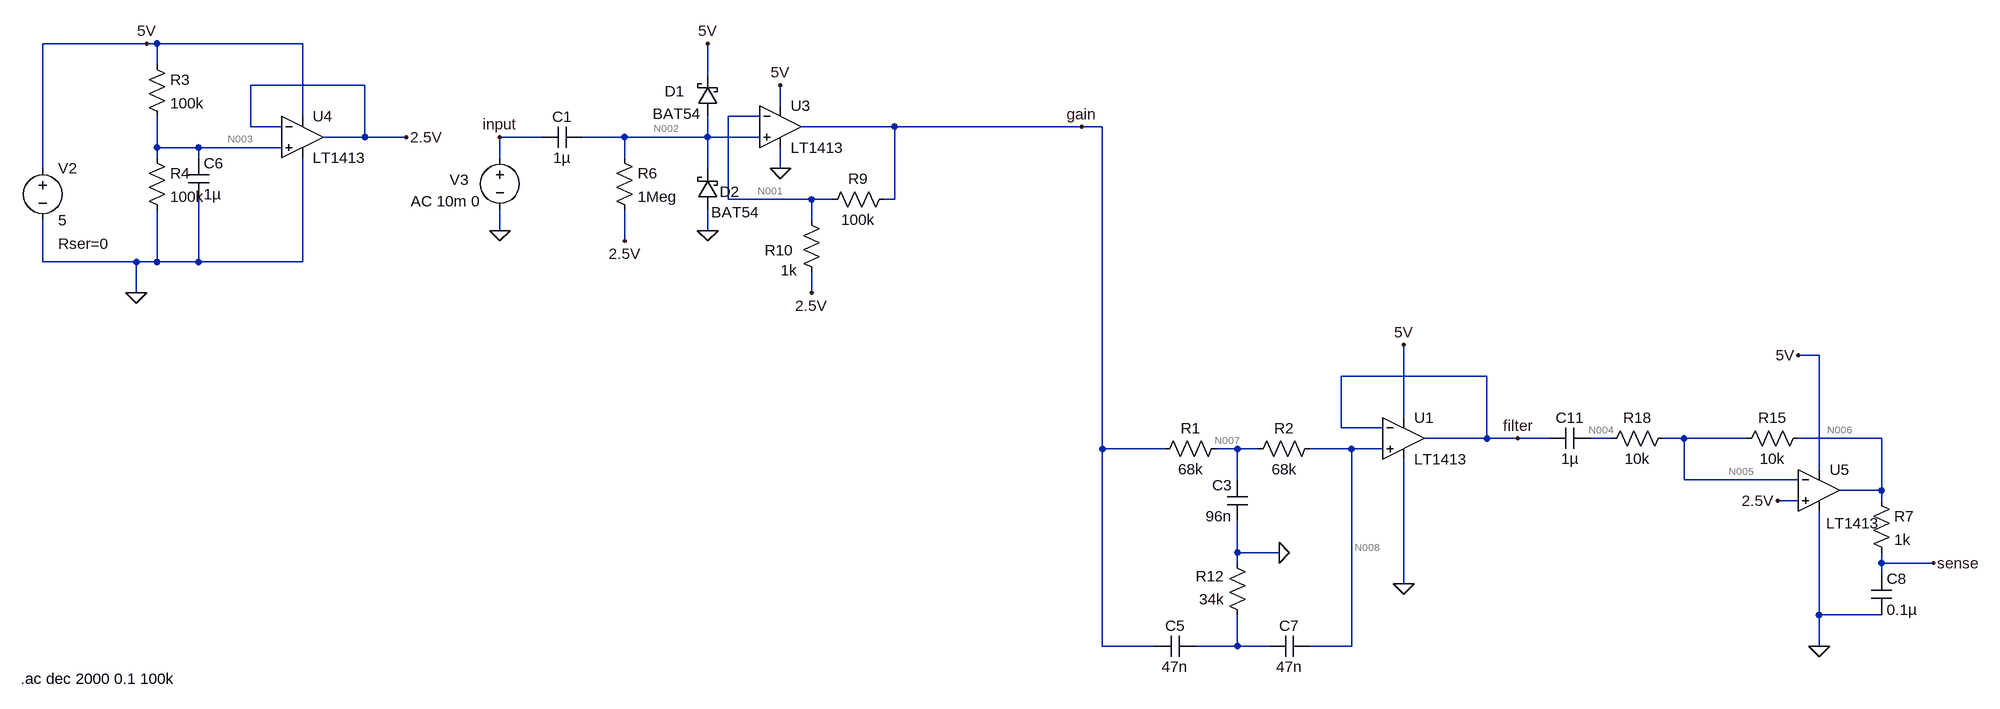
[diagram p0: schematic simulation2.asc]
simulation2.asc, the LTspice schematic file:
Version 4
SHEET 1 1756 1072
WIRE -1088 -16 -1248 -16
WIRE -1072 -16 -1088 -16
WIRE -848 -16 -1072 -16
WIRE -1072 16 -1072 -16
WIRE -224 32 -224 -16
WIRE -752 48 -928 48
WIRE -112 80 -112 48
WIRE -848 96 -848 -16
WIRE -144 96 -192 96
WIRE -928 112 -928 48
WIRE -880 112 -928 112
WIRE 64 112 -80 112
WIRE 352 112 64 112
WIRE 384 112 352 112
WIRE -752 128 -752 48
WIRE -752 128 -816 128
WIRE -688 128 -752 128
WIRE -480 128 -544 128
WIRE -352 128 -416 128
WIRE -224 128 -224 96
WIRE -224 128 -352 128
WIRE -144 128 -224 128
WIRE -1072 144 -1072 96
WIRE -1008 144 -1072 144
WIRE -880 144 -1008 144
WIRE -1072 160 -1072 144
WIRE -1008 160 -1008 144
WIRE -544 160 -544 128
WIRE -352 160 -352 128
WIRE -1248 176 -1248 -16
WIRE -224 176 -224 128
WIRE -112 176 -112 144
WIRE -192 224 -192 96
WIRE -64 224 -192 224
WIRE -32 224 -64 224
WIRE 64 224 64 112
WIRE 64 224 48 224
WIRE -64 256 -64 224
WIRE -544 272 -544 240
WIRE -224 272 -224 240
WIRE -352 288 -352 240
WIRE -1248 320 -1248 256
WIRE -1104 320 -1248 320
WIRE -1072 320 -1072 240
WIRE -1072 320 -1104 320
WIRE -1008 320 -1008 224
WIRE -1008 320 -1072 320
WIRE -848 320 -848 160
WIRE -848 320 -1008 320
WIRE -1104 368 -1104 320
WIRE -64 368 -64 336
WIRE 1488 464 1456 464
WIRE 976 496 752 496
WIRE 848 560 848 448
WIRE 752 576 752 496
WIRE 816 576 752 576
WIRE 976 592 976 496
WIRE 976 592 880 592
WIRE 1024 592 976 592
WIRE 1072 592 1024 592
WIRE 1168 592 1136 592
WIRE 1280 592 1248 592
WIRE 1376 592 1280 592
WIRE 1584 592 1456 592
WIRE 384 608 384 112
WIRE 480 608 384 608
WIRE 592 608 560 608
WIRE 624 608 592 608
WIRE 768 608 704 608
WIRE 816 608 768 608
WIRE 1488 640 1488 464
WIRE 592 656 592 608
WIRE 1280 656 1280 592
WIRE 1456 656 1280 656
WIRE 1584 672 1584 592
WIRE 1584 672 1520 672
WIRE 1456 688 1424 688
WIRE 1584 688 1584 672
WIRE 592 768 592 720
WIRE 656 768 592 768
WIRE 592 784 592 768
WIRE 1584 784 1584 768
WIRE 1664 784 1584 784
WIRE 1584 800 1584 784
WIRE 848 816 848 624
WIRE 1488 864 1488 704
WIRE 1584 864 1488 864
WIRE 384 912 384 608
WIRE 464 912 384 912
WIRE 592 912 592 864
WIRE 592 912 528 912
WIRE 640 912 592 912
WIRE 768 912 768 608
WIRE 768 912 704 912
WIRE 1488 912 1488 864
FLAG -1104 368 0
FLAG -1088 -16 5V
FLAG 1664 784 sense
FLAG -112 176 0
FLAG 352 112 gain
FLAG -544 128 input
FLAG -64 368 2.5V
FLAG 848 816 0
FLAG 848 448 5V
FLAG 1024 592 filter
FLAG 1456 464 5V
FLAG 1424 688 2.5V
FLAG 1488 912 0
FLAG -688 128 2.5V
FLAG -544 272 0
FLAG -352 288 2.5V
FLAG -224 -16 5V
FLAG -112 48 5V
FLAG -224 272 0
FLAG 656 768 0
SYMBOL Opamps\\LT1413 -112 48 R0
SYMATTR InstName U3
SYMBOL voltage -1248 160 R0
WINDOW 123 0 0 Left 2
WINDOW 39 24 132 Left 2
SYMATTR SpiceLine Rser=0
SYMATTR InstName V2
SYMATTR Value 5
SYMBOL res -1088 0 R0
SYMATTR InstName R3
SYMATTR Value 100k
SYMBOL res -1088 144 R0
SYMATTR InstName R4
SYMATTR Value 100k
SYMBOL voltage -544 144 R0
WINDOW 123 -137 83 Left 2
WINDOW 39 0 0 Left 2
WINDOW 3 24 44 Left 2
WINDOW 0 -77 50 Left 2
SYMATTR Value2 AC 10m 0
SYMATTR Value ""
SYMATTR InstName V3
SYMBOL cap -416 112 R90
WINDOW 0 0 32 VBottom 2
WINDOW 3 32 32 VTop 2
SYMATTR InstName C1
SYMATTR Value 1µ
SYMBOL res 64 208 R90
WINDOW 0 0 56 VBottom 2
WINDOW 3 32 56 VTop 2
SYMATTR InstName R9
SYMATTR Value 100k
SYMBOL res -48 352 R180
WINDOW 0 44 50 Left 2
WINDOW 3 38 19 Left 2
SYMATTR InstName R10
SYMATTR Value 1k
SYMBOL cap -1024 160 R0
SYMATTR InstName C6
SYMATTR Value 1µ
SYMBOL res 1568 672 R0
SYMATTR InstName R7
SYMATTR Value 1k
SYMBOL cap 1568 800 R0
SYMATTR InstName C8
SYMATTR Value 0.1µ
SYMBOL Opamps\\LT1413 -848 64 R0
SYMATTR InstName U4
SYMBOL Opamps\\LT1413 848 528 R0
SYMATTR InstName U1
SYMBOL res 576 592 R90
WINDOW 0 0 56 VBottom 2
WINDOW 3 32 56 VTop 2
SYMATTR InstName R1
SYMATTR Value 68k
SYMBOL res 720 592 R90
WINDOW 0 0 56 VBottom 2
WINDOW 3 32 56 VTop 2
SYMATTR InstName R2
SYMATTR Value 68k
SYMBOL res 608 880 R180
WINDOW 0 36 76 Left 2
WINDOW 3 36 40 Left 2
SYMATTR InstName R12
SYMATTR Value 34k
SYMBOL cap 608 720 R180
WINDOW 0 24 56 Left 2
WINDOW 3 24 8 Left 2
SYMATTR InstName C3
SYMATTR Value 96n
SYMBOL cap 464 928 R270
WINDOW 0 32 32 VTop 2
WINDOW 3 0 32 VBottom 2
SYMATTR InstName C5
SYMATTR Value 47n
SYMBOL cap 640 928 R270
WINDOW 0 32 32 VTop 2
WINDOW 3 0 32 VBottom 2
SYMATTR InstName C7
SYMATTR Value 47n
SYMBOL schottky -208 96 R180
WINDOW 0 51 39 Left 2
WINDOW 3 27 4 Left 2
SYMATTR InstName D1
SYMATTR Value BAT54
SYMATTR Description Diode
SYMATTR Type diode
SYMBOL schottky -208 240 R180
WINDOW 0 -33 28 Left 2
WINDOW 3 -63 -4 Left 2
SYMATTR InstName D2
SYMATTR Value BAT54
SYMATTR Description Diode
SYMATTR Type diode
SYMBOL Opamps\\LT1413 1488 608 R0
WINDOW 3 11 115 Left 2
SYMATTR InstName U5
SYMBOL res 1472 576 R90
WINDOW 0 0 56 VBottom 2
WINDOW 3 32 56 VTop 2
SYMATTR InstName R15
SYMATTR Value 10k
SYMBOL res 1264 576 R90
WINDOW 0 0 56 VBottom 2
WINDOW 3 32 56 VTop 2
SYMATTR InstName R18
SYMATTR Value 10k
SYMBOL cap 1136 576 R90
WINDOW 0 0 32 VBottom 2
WINDOW 3 32 32 VTop 2
SYMATTR InstName C11
SYMATTR Value 1µ
SYMBOL res -368 144 R0
SYMATTR InstName R6
SYMATTR Value 1Meg
TEXT -1282 962 Left 2 !.ac dec 2000 0.1 100k

The netlist it stands for:
* simulation2.asc
XU3 N002 N001 5V 0 gain LT1413  ; pins In+ In- V+ V- OUT
V2 5V 0 5 Rser=0
R3 5V N003 100k
R4 N003 0 100k
V3 input 0 AC 10m 0
C1 N002 input 1µ
R9 gain N001 100k
R10 2.5V N001 1k
C6 N003 0 1µ
R7 N006 sense 1k
C8 sense 0 0.1µ
XU4 N003 2.5V 5V 0 2.5V LT1413  ; pins In+ In- V+ V- OUT
XU1 N008 filter 5V 0 filter LT1413  ; pins In+ In- V+ V- OUT
R1 N007 gain 68k
R2 N008 N007 68k
R12 N009 0 34k
C3 0 N007 96n
C5 gain N009 47n
C7 N009 N008 47n
D1 N002 5V BAT54
D2 0 N002 BAT54
XU5 2.5V N005 5V 0 N006 LT1413  ; pins In+ In- V+ V- OUT
R15 N006 N005 10k
R18 N005 N004 10k
C11 N004 filter 1µ
R6 N002 2.5V 1Meg
.model D D
.lib standard.dio
.ac dec 2000 0.1 100k
.lib LTC.lib
.backanno
.end

* Results of the author's LTspice run, read from the files saved beside the schematic
* Operating Point, zero values left out:
*   V(n001) = 2.513 V
*   V(n002) = 2.513 V
*   V(5v) = 5 V
*   V(gain) = 3.711 V
*   V(n003) = 2.501 V
*   V(2.5v) = 2.501 V
*   V(n006) = 2.5 V
*   V(sense) = 2.5 V
*   V(filter) = 3.713 V
*   V(n008) = 3.713 V
*   V(n007) = 3.712 V
*   V(n005) = 2.501 V
*   V(n004) = 2.501 V
*   I(D2) = -100 nA
*   I(D1) = -100 nA
*   I(R6) = 12 nA
*   I(R15) = -12 nA
*   I(R2) = 11.88 nA
*   I(R1) = 11.88 nA
*   I(R10) = -12 µA
*   I(R9) = 11.99 µA
*   I(R4) = 25.01 µA
*   I(R3) = 24.99 µA
*   I(V2) = -1.425 mA